# Altium schematic sheet SPCE061A原理图.SchDoc
size A4
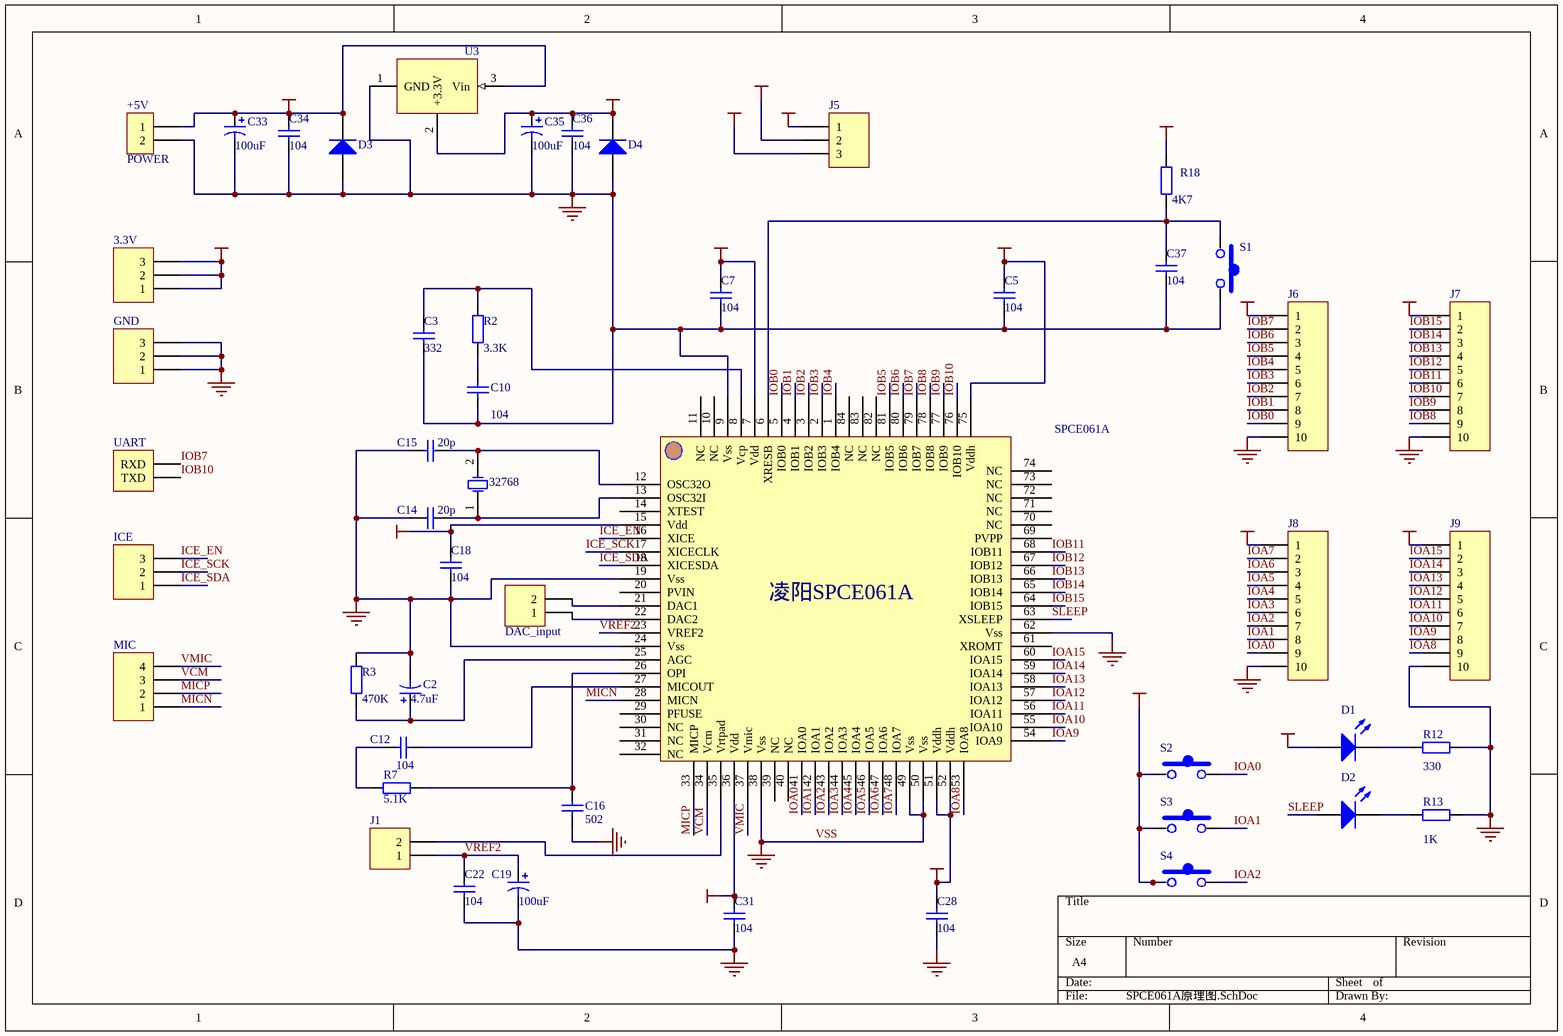
[diagram p0: SPCE061A原理图.SchDoc]

## Parts
3.3V  Header 3  [HDR1X3]  (value not drawn)
32768  XTAL  [BCY-W2/D3.1]  (value not drawn)
+5V  POWER  [HDR-2]
C2  value 4.7uF  [C-DJ-4]  (hidden comment: Cap Pol1)
C3  value 332  [CAPR2.54-5.1x3.2]  (hidden comment: Cap)
C5  value 104  [CAPR2.54-5.1x3.2]  (hidden comment: Cap)
C7  value 104  [CAPR2.54-5.1x3.2]  (hidden comment: Cap)
C10  value 104  [CAPR2.54-5.1x3.2]  (hidden comment: Cap)
C12  value 104  [CAPR2.54-5.1x3.2]  (hidden comment: Cap)
C14  value 20p  [CAPR2.54-5.1x3.2]  (hidden comment: Cap)
C15  value 20p  [CAPR2.54-5.1x3.2]  (hidden comment: Cap)
C16  value 502  [CAPR2.54-5.1x3.2]  (hidden comment: Cap)
C18  value 104  [CAPR2.54-5.1x3.2]  (hidden comment: Cap)
C19  value 100uF  [C-DJ-4]  (hidden comment: Cap Pol1)
C22  value 104  [CAPR2.54-5.1x3.2]  (hidden comment: Cap)
C28  value 104  [CAPR2.54-5.1x3.2]  (hidden comment: Cap)
C31  value 104  [CAPR2.54-5.1x3.2]  (hidden comment: Cap)
C33  value 100uF  [C-DJ-4]  (hidden comment: Cap Pol1)
C34  value 104  [CAPR2.54-5.1x3.2]  (hidden comment: Cap)
C35  value 100uF  [C-DJ-4]  (hidden comment: Cap Pol1)
C36  value 104  [CAPR2.54-5.1x3.2]  (hidden comment: Cap)
C37  value 104  [CAPR2.54-5.1x3.2]  (hidden comment: Cap)
D1  LED3  [SMD _LED]  (value not drawn)
D2  LED3  [SMD _LED]  (value not drawn)
D3  Diode 1N4148  [DIO7.1-3.9x1.9]  (value not drawn)
D4  Diode 1N4148  [DIO7.1-3.9x1.9]  (value not drawn)
DAC_input  Header 2  [HDR1X2]  (value not drawn)
GND  Header 3  [HDR1X3]  (value not drawn)
ICE  Header 3  [HDR1X3]  (value not drawn)
J1  Header 2  [HDR1X2]  (value not drawn)
J5  Header 3  [HDR1X3]  (value not drawn)
J6  IOB0~IOB7  [HDR1X10]  (value not drawn)
J7  IOB8~IOB15  [HDR1X10]  (value not drawn)
J8  IOA0~IOA7  [HDR1X10]  (value not drawn)
J9  IOA8~IOA15  [HDR1X10]  (value not drawn)
MIC  Header 4  [HDR1X4]  (value not drawn)
R2  value 3.3K  [AXIAL-0.4]  (hidden comment: Res2)
R3  value 470K  [AXIAL-0.4]  (hidden comment: Res2)
R7  value 5.1K  [AXIAL-0.4]  (hidden comment: Res2)
R12  value 330  [AXIAL-0.4]  (hidden comment: Res2)
R13  value 1K  [AXIAL-0.4]  (hidden comment: Res2)
R18  value 4K7  [AXIAL-0.4]  (hidden comment: Res2)
S1  KEY  [an-6*6]  (value not drawn)
S2  KEY2  [an-6*6]  (value not drawn)
S3  KEY3  [an-6*6]  (value not drawn)
S4  KEY4  [an-6*6]  (value not drawn)
SPCE061A  PLCC84  [SPCE061A_PLCC84]  (value not drawn)
U3  LM7833  [A1117]  (value not drawn)
UART  Header 2  [HDR1X2]  (value not drawn)

## Nets
V5: +5V.1 C33.1 C34.2 D3.2(K) J5.1 S2.1 S3.1 S4.1 U3.3(Vin)
VDD: 3.3V.1 3.3V.2 3.3V.3 C7.2 C18.2 C31.2 C35.1 C36.2 D1.1(A) D4.2(K) J5.3 R18.2 SPCE061A.7(Vdd) SPCE061A.15(Vdd) SPCE061A.36(Vdd) U3.2(+3.3V)
VDDH: C5.2 C28.2 J5.2 J6.1 J7.1 J8.1 J9.1 SPCE061A.51(Vddh) SPCE061A.52(Vddh) SPCE061A.75(Vddh)
VSS: +5V.2 C2.2 C3.1 C5.1 C7.1 C10.1 C14.1 C15.2 C16.2 C18.1 C19.2 C22.1 C28.1 C31.1 C33.2 C34.1 C35.2 C36.1 C37.2 D3.1(A) D4.1(A) GND.1 GND.2 GND.3 J6.10 J7.10 J8.10 J9.10 R3.2 R12.2 R13.2 S1.2 SPCE061A.9(Vss) SPCE061A.19(Vss) SPCE061A.24(Vss) SPCE061A.38(Vss) SPCE061A.49(Vss) SPCE061A.50(Vss) SPCE061A.62(Vss) U3.1(GND)
ICE_EN: ICE.3 SPCE061A.16(XICE)
ICE_SCK: ICE.2 SPCE061A.17(XICECLK)
ICE_SDA: ICE.1 SPCE061A.18(XICESDA)
IOA0: J8.9 S2.2 SPCE061A.41(IOA0)
IOA1: J8.8 S3.2 SPCE061A.42(IOA1)
IOA2: J8.7 S4.2 SPCE061A.43(IOA2)
IOA3: J8.6 SPCE061A.44(IOA3)
IOA4: J8.5 SPCE061A.45(IOA4)
IOA5: J8.4 SPCE061A.46(IOA5)
IOA6: J8.3 SPCE061A.47(IOA6)
IOA7: J8.2 SPCE061A.48(IOA7)
IOA8: J9.9 SPCE061A.53(IOA8)
IOA9: J9.8 SPCE061A.54(IOA9)
IOA10: J9.7 SPCE061A.55(IOA10)
IOA11: J9.6 SPCE061A.56(IOA11)
IOA12: J9.5 SPCE061A.57(IOA12)
IOA13: J9.4 SPCE061A.58(IOA13)
IOA14: J9.3 SPCE061A.59(IOA14)
IOA15: J9.2 SPCE061A.60(IOA15)
IOB0: J6.9 SPCE061A.5(IOB0)
IOB1: J6.8 SPCE061A.4(IOB1)
IOB2: J6.7 SPCE061A.3(IOB2)
IOB3: J6.6 SPCE061A.2(IOB3)
IOB4: J6.5 SPCE061A.1(IOB4)
IOB5: J6.4 SPCE061A.81(IOB5)
IOB6: J6.3 SPCE061A.80(IOB6)
IOB7: J6.2 SPCE061A.79(IOB7) UART.2(RXD)
IOB8: J7.9 SPCE061A.78(IOB8)
IOB9: J7.8 SPCE061A.77(IOB9)
IOB10: J7.7 SPCE061A.76(IOB10) UART.1(TXD)
IOB11: J7.6 SPCE061A.68(IOB11)
IOB12: J7.5 SPCE061A.67(IOB12)
IOB13: J7.4 SPCE061A.66(IOB13)
IOB14: J7.3 SPCE061A.65(IOB14)
IOB15: J7.2 SPCE061A.64(IOB15)
MICN: MIC.1 SPCE061A.28(MICN)
MICP: MIC.2 SPCE061A.33(MICP)
SLEEP: D2.1(A) SPCE061A.63(XSLEEP)
VCM: MIC.3 SPCE061A.34(Vcm)
VMIC: MIC.4 SPCE061A.37(Vmic)
VREF2: C19.1 C22.2 J1.1 SPCE061A.23(VREF2)
Net32768_1: 32768.1(OSC1) C14.2 SPCE061A.13(OSC32I)
Net32768_2: 32768.2(OSC2) C15.1 SPCE061A.12(OSC32O)
NetC2_1: C2.1 R3.1 SPCE061A.25(AGC)
NetC3_2: C3.2 R2.2 SPCE061A.8(Vcp)
NetC10_2: C10.2 R2.1
NetC12_1: C12.1 SPCE061A.27(MICOUT)
NetC12_2: C12.2 R7.2
NetC16_1: C16.1 R7.1 SPCE061A.26(OPI)
NetC37_1: C37.1 R18.1 S1.1 SPCE061A.6(XRESB)
NetD1_2: D1.2(K) R12.1
NetD2_2: D2.2(K) R13.1
NetDAC_input_1: DAC_input.1 SPCE061A.22(DAC2)
NetDAC_input_2: DAC_input.2 SPCE061A.21(DAC1)
NetJ1_2: J1.2 SPCE061A.35(Vrtpad)

Not connected (* = marked no-connect by the designer): SPCE061A 10(NC) 11(NC) 14(XTEST) 20(PVIN) 29(PFUSE) 30(NC) 31(NC) 32(NC) 39(NC) 40(NC) 61(XROMT) 69(PVPP) 70(NC) 71(NC) 72(NC) 73(NC) 74(NC) 82(NC) 83(NC) 84(NC)

## Notes on the sheet
- (in symbol SPCE061A_PLCC84) 凌阳SPCE061A

## Library data of the parts
3.3V GND ICE J5 = Header 3: Header, 3-Pin; LatestRevisionDate: 17-Jul-2002; LatestRevisionNote: Re-released for DXP Platform.; Publisher: Altium Limited
32768 = XTAL: Crystal Oscillator; Published: 8-Jun-2000; LatestRevisionDate: 17-Jul-2002; LatestRevisionNote: Re-released for DXP Platform.; Publisher: Altium Limited
C2 C19 C33 C35 = Cap Pol1: Polarized Capacitor (Radial); Published: 8-Jun-2000; LatestRevisionDate: 17-Jul-2002; LatestRevisionNote: Re-released for DXP Platform.; Publisher: Altium Limited
C3 C5 C7 C10 C12 C14-C16 C18 C22 C28 C31 C34 C36 C37 = Cap: Capacitor; Published: 8-Jun-2000; LatestRevisionDate: 17-Jul-2002; LatestRevisionNote: Re-released for DXP Platform.; Publisher: Altium Limited
D1 D2 = LED3: Typical BLUE SiC LED; Published: 8-Jun-2000; LatestRevisionDate: 17-Dec-2003; LatestRevisionNote: PCB Footprint replaced.; Publisher: Altium Limited
D3 D4 = Diode 1N4148: High Conductance Fast Diode; Published: 8-Jun-2000; LatestRevisionDate: 17-Jul-2002; LatestRevisionNote: Re-released for DXP Platform.; DatasheetDocument: 1997; PackageReference: DO-35; Publisher: Altium Limited; Code_JEDEC: DO-204-AH
DAC_input J1 UART = Header 2: Header, 2-Pin; LatestRevisionDate: 17-Jul-2002; LatestRevisionNote: Re-released for DXP Platform.; Publisher: Altium Limited
J6-J9 = Header 10: Header, 10-Pin; LatestRevisionDate: 17-Jul-2002; LatestRevisionNote: Re-released for DXP Platform.; Publisher: Altium Limited
MIC = Header 4: Header, 4-Pin; LatestRevisionDate: 17-Jul-2002; LatestRevisionNote: Re-released for DXP Platform.; Publisher: Altium Limited
R2 R3 R7 R12 R13 R18 = Res2: Resistor; Published: 8-Jun-2000; LatestRevisionDate: 17-Jul-2002; LatestRevisionNote: Re-released for DXP Platform.; Publisher: Altium Limited
S2-S4 = KEY
SPCE061A = SPCE061A_PLCC84
U3 = LM7805CT